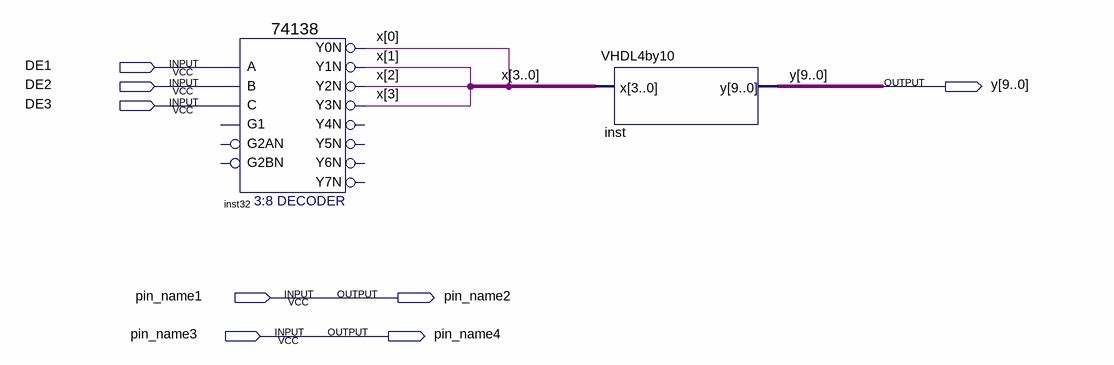
[diagram p0: schematic sheet]
// Quartus schematic insideinput.bdf as structural Verilog: 2 symbols, 8 pins
module insideinput (
  input  DE1,
  input  DE2,
  input  DE3,
  input  pin_name1,
  input  pin_name3,
  output [9:0] y,
  output pin_name2,
  output pin_name4
);

  wire [3:0] x;

  \74138  inst32 (
    .A(DE1), .B(DE2), .C(DE3), .Y0N(x[0]), .Y1N(x[1]), .Y2N(x[2]), .Y3N(x[3]));  // open: G1, G2AN, G2BN, Y4N, Y5N, Y6N, Y7N
  VHDL4by10 inst (.x(x), .y(y));

  assign pin_name2 = pin_name1;
  assign pin_name4 = pin_name3;
endmodule
